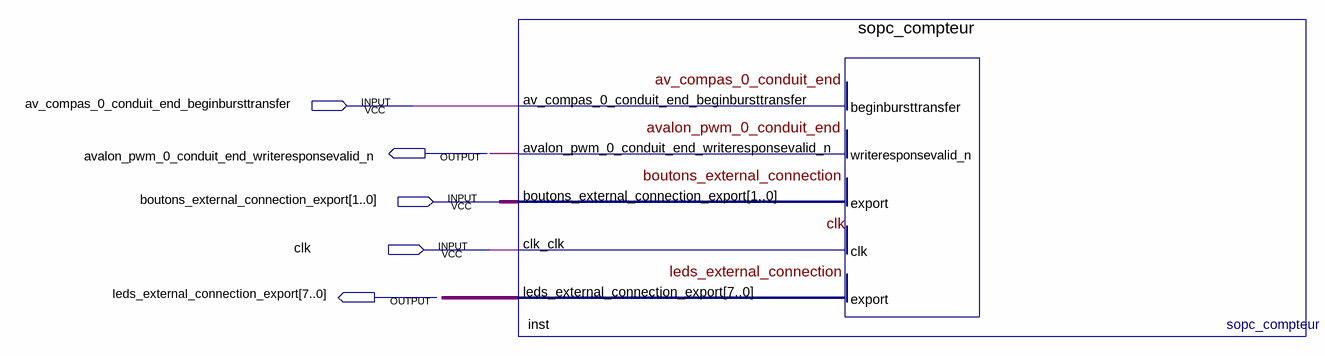
[diagram p0: schematic sheet]
// Quartus schematic sopc.bdf as structural Verilog: 1 symbols, 5 pins
module sopc (
  input  av_compas_0_conduit_end_beginbursttransfer,
  input  [1:0] boutons_external_connection_export,
  input  clk,
  output avalon_pwm_0_conduit_end_writeresponsevalid_n,
  output [7:0] leds_external_connection_export
);

  sopc_compteur inst (
    .av_compas_0_conduit_end_beginbursttransfer(av_compas_0_conduit_end_beginbursttransfer),
    .boutons_external_connection_export(boutons_external_connection_export), .clk_clk(clk),
    .avalon_pwm_0_conduit_end_writeresponsevalid_n(avalon_pwm_0_conduit_end_writeresponsevalid_n),
    .leds_external_connection_export(leds_external_connection_export));
endmodule
